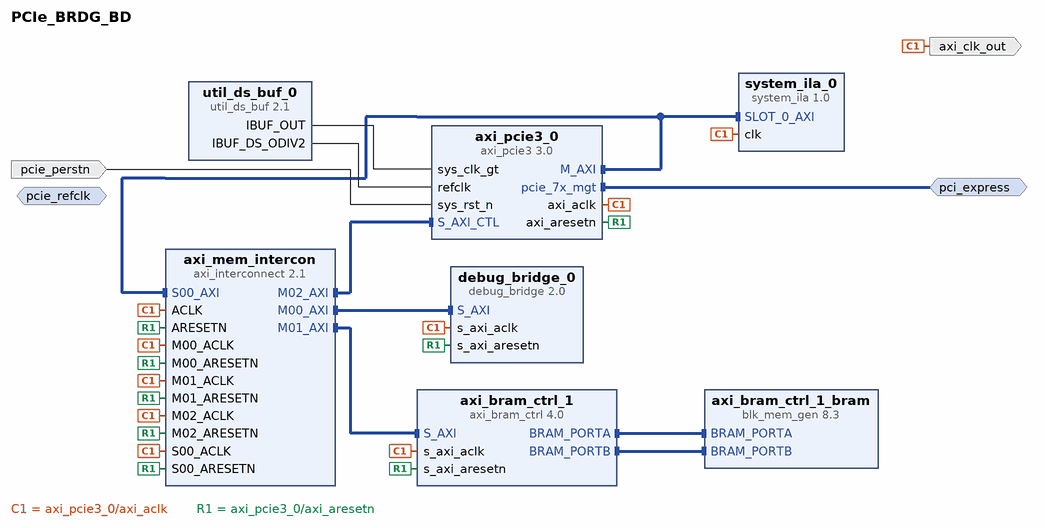
[diagram p0: block diagram of the top level]
# Vivado block design PCIe_BRDG_BD, xcku040-ffva1156-2-e, Vivado 2017.1
create_bd_design PCIe_BRDG_BD

create_bd_intf_port -mode Master -vlnv xilinx.com:interface:pcie_7x_mgt_rtl:1.0 pci_express
create_bd_intf_port -mode Slave -vlnv xilinx.com:interface:diff_clock_rtl:1.0 pcie_refclk
set_property -dict {CONFIG.FREQ_HZ 100000000} [get_bd_intf_ports pcie_refclk]
create_bd_port -dir I -type rst pcie_perstn
set_property -dict {CONFIG.POLARITY ACTIVE_LOW} [get_bd_ports pcie_perstn]
create_bd_port -dir O -type clk axi_clk_out

create_bd_cell -type ip -vlnv xilinx.com:ip:util_ds_buf:2.1 util_ds_buf_0
set_property -dict [list \
  CONFIG.C_BUF_TYPE IBUFDSGTE \
  CONFIG.USE_BOARD_FLOW true \
  CONFIG.DIFF_CLK_IN_BOARD_INTERFACE Custom \
] [get_bd_cells util_ds_buf_0]
create_bd_cell -type ip -vlnv xilinx.com:ip:axi_bram_ctrl:4.0 axi_bram_ctrl_1
create_bd_cell -type ip -vlnv xilinx.com:ip:blk_mem_gen:8.3 axi_bram_ctrl_1_bram
set_property -dict [list \
  CONFIG.Memory_Type True_Dual_Port_RAM \
  CONFIG.Enable_B Use_ENB_Pin \
  CONFIG.Use_RSTB_Pin true \
  CONFIG.Port_B_Clock 100 \
  CONFIG.Port_B_Write_Rate 50 \
  CONFIG.Port_B_Enable_Rate 100 \
] [get_bd_cells axi_bram_ctrl_1_bram]
create_bd_cell -type ip -vlnv xilinx.com:ip:axi_interconnect:2.1 axi_mem_intercon
set_property -dict [list \
  CONFIG.NUM_MI 3 \
  CONFIG.M00_HAS_REGSLICE 4 \
  CONFIG.M01_HAS_REGSLICE 4 \
  CONFIG.M02_HAS_REGSLICE 4 \
  CONFIG.S00_HAS_REGSLICE 4 \
] [get_bd_cells axi_mem_intercon]
create_bd_cell -type ip -vlnv xilinx.com:ip:axi_pcie3:3.0 axi_pcie3_0
set_property -dict [list \
  CONFIG.mode_selection Advanced \
  CONFIG.pl_link_cap_max_link_width X8 \
  CONFIG.pl_link_cap_max_link_speed 8.0_GT/s \
  CONFIG.axi_data_width 256_bit \
  CONFIG.axisten_freq 250 \
  CONFIG.en_axi_slave_if false \
  CONFIG.pf0_device_id 8018 \
  CONFIG.pf0_bar0_size 256 \
  CONFIG.pf0_interrupt_pin NONE \
  CONFIG.pf0_msi_enabled false \
  CONFIG.SYS_RST_N_BOARD_INTERFACE Custom \
  CONFIG.PCIE_BOARD_INTERFACE Custom \
] [get_bd_cells axi_pcie3_0]
create_bd_cell -type ip -vlnv xilinx.com:ip:debug_bridge:2.0 debug_bridge_0
set_property -dict {CONFIG.C_DEBUG_MODE 2 CONFIG.C_EN_BSCANID_VEC true} [get_bd_cells debug_bridge_0]
create_bd_cell -type ip -vlnv xilinx.com:ip:system_ila:1.0 system_ila_0
set_property -dict {CONFIG.C_MON_TYPE INTERFACE} [get_bd_cells system_ila_0]

# ---- connections ----

connect_bd_intf_net [get_bd_intf_pins axi_pcie3_0/M_AXI] [get_bd_intf_pins axi_mem_intercon/S00_AXI]
connect_bd_intf_net [get_bd_intf_pins axi_pcie3_0/M_AXI] [get_bd_intf_pins system_ila_0/SLOT_0_AXI]
connect_bd_intf_net [get_bd_intf_pins axi_mem_intercon/M01_AXI] [get_bd_intf_pins axi_bram_ctrl_1/S_AXI]
connect_bd_intf_net [get_bd_intf_pins axi_bram_ctrl_1_bram/BRAM_PORTA] [get_bd_intf_pins axi_bram_ctrl_1/BRAM_PORTA]
connect_bd_intf_net [get_bd_intf_pins axi_bram_ctrl_1_bram/BRAM_PORTB] [get_bd_intf_pins axi_bram_ctrl_1/BRAM_PORTB]
connect_bd_intf_net [get_bd_intf_pins axi_mem_intercon/M02_AXI] [get_bd_intf_pins axi_pcie3_0/S_AXI_CTL]
connect_bd_intf_net [get_bd_intf_pins axi_mem_intercon/M00_AXI] [get_bd_intf_pins debug_bridge_0/S_AXI]
connect_bd_intf_net [get_bd_intf_ports pci_express] [get_bd_intf_pins axi_pcie3_0/pcie_7x_mgt]
connect_bd_net [get_bd_ports pcie_perstn] [get_bd_pins axi_pcie3_0/sys_rst_n]
connect_bd_net [get_bd_pins axi_pcie3_0/axi_aclk] \
  [get_bd_ports axi_clk_out] [get_bd_pins axi_bram_ctrl_1/s_axi_aclk] [get_bd_pins axi_mem_intercon/ACLK] \
  [get_bd_pins axi_mem_intercon/S00_ACLK] [get_bd_pins axi_mem_intercon/M00_ACLK] [get_bd_pins axi_mem_intercon/M01_ACLK] \
  [get_bd_pins axi_mem_intercon/M02_ACLK] [get_bd_pins debug_bridge_0/s_axi_aclk] [get_bd_pins system_ila_0/clk]
connect_bd_net [get_bd_pins axi_pcie3_0/axi_aresetn] \
  [get_bd_pins axi_bram_ctrl_1/s_axi_aresetn] [get_bd_pins axi_mem_intercon/ARESETN] \
  [get_bd_pins axi_mem_intercon/S00_ARESETN] [get_bd_pins axi_mem_intercon/M00_ARESETN] \
  [get_bd_pins axi_mem_intercon/M01_ARESETN] [get_bd_pins axi_mem_intercon/M02_ARESETN] \
  [get_bd_pins debug_bridge_0/s_axi_aresetn]
connect_bd_net [get_bd_pins util_ds_buf_0/IBUF_OUT] [get_bd_pins axi_pcie3_0/sys_clk_gt]
connect_bd_net [get_bd_pins util_ds_buf_0/IBUF_DS_ODIV2] [get_bd_pins axi_pcie3_0/refclk]

# ---- address map ----
assign_bd_address -offset 0x00000000 -range 64K -target_address_space [get_bd_addr_spaces axi_pcie3_0/M_AXI] [get_bd_addr_segs debug_bridge_0/S_AXI/Reg0]
assign_bd_address -offset 0x00010000 -range 8K -target_address_space [get_bd_addr_spaces axi_pcie3_0/M_AXI] [get_bd_addr_segs axi_bram_ctrl_1/S_AXI/Mem0]
assign_bd_address -offset 0x00012000 -range 8K -target_address_space [get_bd_addr_spaces axi_pcie3_0/M_AXI] [get_bd_addr_segs axi_pcie3_0/S_AXI_CTL/CTL0]

validate_bd_design
save_bd_design
